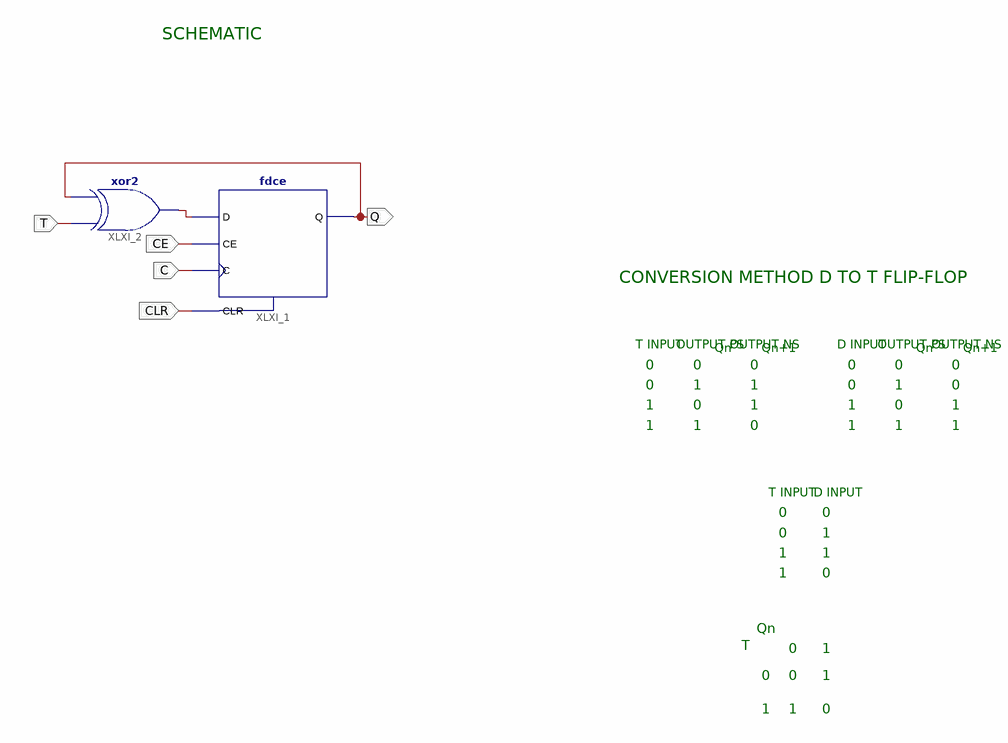
[diagram p0: schematic sheet 1]
// Xilinx ISE schematic t_flipflop.sch (spartan3e) as structural Verilog: 2 symbols, 5 ports
module t_flipflop (
  input  T,
  input  CE,
  input  C,
  input  CLR,
  output Q
);

  wire XLXN_1;

  fdce XLXI_1 (.C(C), .CE(CE), .CLR(CLR), .D(XLXN_1), .Q(Q));
  xor XLXI_2 (XLXN_1, T, Q);

  // Notes on the sheet:
  //   SCHEMATIC
  //   CONVERSION METHOD D TO T FLIP-FLOP
  //   T INPUT
  //   OUTPUT PS
  //   OUTPUT NS
  //   D INPUT
  //   OUTPUT PS
  //   OUTPUT NS
  //   Qn
  //   Qn+1
  //   Qn
  //   Qn+1
  //   0
  //   0
  //   0
  //   0
  //   0
  //   0
  //   0
  //   1
  //   1
  //   0
  //   1
  //   0
  //   1
  //   0
  //   1
  //   1
  //   0
  //   1
  //   1
  //   1
  //   0
  //   1
  //   1
  //   1
  //   T INPUT
  //   D INPUT
  //   0
  //   0
  //   0
  //   1
  //   1
  //   1
  //   1
  //   0
  //   Qn
  //   T
  //   0
  //   1
  //   0
  //   0
  //   1
  //   1
  //   1
  //   0
endmodule
